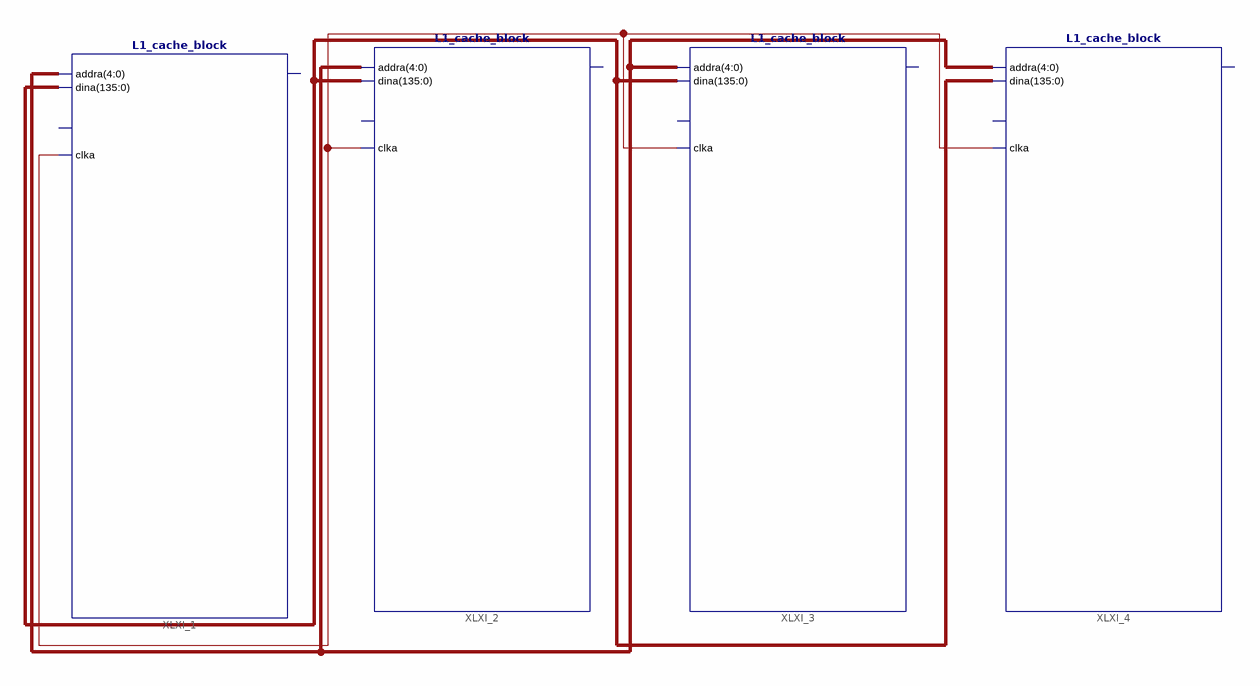
[diagram p0: schematic sheet 1]
// Xilinx ISE schematic l1_cache.sch (spartan6) as structural Verilog: 4 symbols, 0 ports
module l1_cache (
);

  wire XLXN_8;
  wire [4:0] XLXN_3;
  wire [135:0] XLXN_9;

  L1_cache_block XLXI_1 (.addra(XLXN_3), .dina(XLXN_9), .clka(XLXN_8));  // open: wea, douta
  L1_cache_block XLXI_2 (.addra(XLXN_3), .dina(XLXN_9), .clka(XLXN_8));  // open: wea, douta
  L1_cache_block XLXI_4 (.addra(XLXN_3), .dina(XLXN_9), .clka(XLXN_8));  // open: wea, douta
  L1_cache_block XLXI_3 (.addra(XLXN_3), .dina(XLXN_9), .clka(XLXN_8));  // open: wea, douta
endmodule
